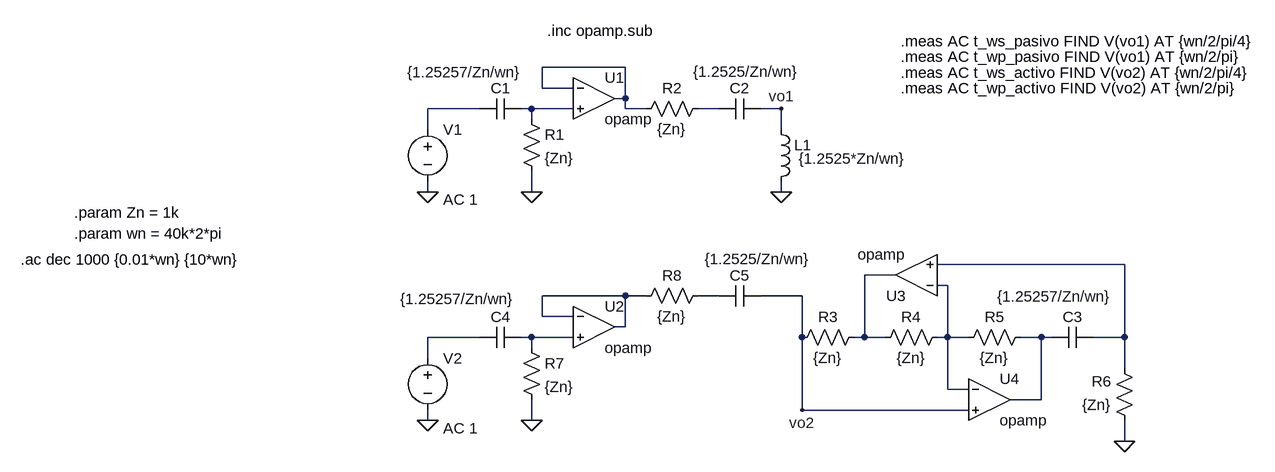
[diagram p0: schematic sim.asc]
sim.asc, the LTspice schematic file:
Version 4
SHEET 1 1212 680
WIRE 176 16 48 16
WIRE 48 48 48 16
WIRE 96 48 48 48
WIRE 176 64 176 16
WIRE 176 64 160 64
WIRE -48 80 -128 80
WIRE 32 80 16 80
WIRE 96 80 32 80
WIRE 176 80 176 64
WIRE 208 80 176 80
WIRE 320 80 288 80
WIRE 416 80 384 80
WIRE 32 96 32 80
WIRE -128 112 -128 80
WIRE 416 112 416 80
WIRE -128 208 -128 192
WIRE 32 208 32 176
WIRE 416 208 416 192
WIRE 944 320 656 320
WIRE 592 336 544 336
WIRE 672 352 656 352
WIRE 176 368 48 368
WIRE 208 368 176 368
WIRE 320 368 288 368
WIRE 448 368 384 368
WIRE 48 400 48 368
WIRE 96 400 48 400
WIRE 176 416 176 368
WIRE 176 416 160 416
WIRE -48 432 -128 432
WIRE 32 432 16 432
WIRE 96 432 32 432
WIRE 448 432 448 368
WIRE 544 432 544 336
WIRE 544 432 528 432
WIRE 576 432 544 432
WIRE 672 432 672 352
WIRE 672 432 656 432
WIRE 704 432 672 432
WIRE 816 432 784 432
WIRE 832 432 816 432
WIRE 944 432 944 320
WIRE 944 432 896 432
WIRE 32 448 32 432
WIRE -128 464 -128 432
WIRE 944 480 944 432
WIRE 672 512 672 432
WIRE 704 512 672 512
WIRE 816 528 816 432
WIRE 816 528 768 528
WIRE 448 544 448 432
WIRE 704 544 448 544
WIRE -128 560 -128 544
WIRE 32 560 32 528
WIRE 944 592 944 560
FLAG 32 208 0
FLAG 416 208 0
FLAG -128 208 0
FLAG 944 592 0
FLAG 32 560 0
FLAG -128 560 0
FLAG 416 80 vo1
FLAG 448 544 vo2
SYMBOL cap 16 64 R90
WINDOW 0 0 32 VBottom 2
WINDOW 3 -56 87 VTop 2
SYMATTR InstName C1
SYMATTR Value {1.25257/Zn/wn}
SYMBOL res 16 80 R0
SYMATTR InstName R1
SYMATTR Value {Zn}
SYMBOL res 304 64 R90
WINDOW 0 0 56 VBottom 2
WINDOW 3 32 56 VTop 2
SYMATTR InstName R2
SYMATTR Value {Zn}
SYMBOL cap 384 64 R90
WINDOW 0 0 32 VBottom 2
WINDOW 3 -57 22 VTop 2
SYMATTR InstName C2
SYMATTR Value {1.2525/Zn/wn}
SYMBOL ind 400 96 R0
WINDOW 3 43 61 Left 2
SYMATTR InstName L1
SYMATTR Value {1.2525*Zn/wn}
SYMBOL voltage -128 96 R0
WINDOW 123 24 124 Left 2
WINDOW 39 0 0 Left 0
SYMATTR InstName V1
SYMATTR Value ""
SYMATTR Value2 AC 1
SYMBOL OpAmps\\opamp 128 0 R0
SYMATTR InstName U1
SYMATTR SpiceLine2 GBW=10G
SYMBOL res 544 416 R90
WINDOW 0 0 56 VBottom 2
WINDOW 3 32 56 VTop 2
SYMATTR InstName R3
SYMATTR Value {Zn}
SYMBOL res 672 416 R90
WINDOW 0 0 56 VBottom 2
WINDOW 3 32 56 VTop 2
SYMATTR InstName R4
SYMATTR Value {Zn}
SYMBOL res 800 416 R90
WINDOW 0 0 56 VBottom 2
WINDOW 3 32 56 VTop 2
SYMATTR InstName R5
SYMATTR Value {Zn}
SYMBOL res 960 576 R180
WINDOW 0 36 76 Left 2
WINDOW 3 36 40 Left 2
SYMATTR InstName R6
SYMATTR Value {Zn}
SYMBOL cap 896 416 R90
WINDOW 0 0 32 VBottom 2
WINDOW 3 -63 59 VTop 2
SYMATTR InstName C3
SYMATTR Value {1.25257/Zn/wn}
SYMBOL cap 16 416 R90
WINDOW 0 0 32 VBottom 2
WINDOW 3 -59 98 VTop 2
SYMATTR InstName C4
SYMATTR Value {1.25257/Zn/wn}
SYMBOL res 16 432 R0
SYMATTR InstName R7
SYMATTR Value {Zn}
SYMBOL voltage -128 448 R0
WINDOW 123 24 124 Left 2
WINDOW 39 0 0 Left 0
SYMATTR InstName V2
SYMATTR Value ""
SYMATTR Value2 AC 1
SYMBOL res 304 352 R90
WINDOW 0 0 56 VBottom 2
WINDOW 3 32 56 VTop 2
SYMATTR InstName R8
SYMATTR Value {Zn}
SYMBOL cap 384 352 R90
WINDOW 0 0 32 VBottom 2
WINDOW 3 -56 4 VTop 2
SYMATTR InstName C5
SYMATTR Value {1.2525/Zn/wn}
SYMBOL OpAmps\\opamp 128 352 R0
SYMATTR InstName U2
SYMATTR SpiceLine2 GBW=10G
SYMBOL OpAmps\\opamp 624 400 R180
SYMATTR InstName U3
SYMATTR SpiceLine2 GBW=10G
SYMBOL OpAmps\\opamp 736 464 R0
SYMATTR InstName U4
SYMATTR SpiceLine2 GBW=10G
TEXT -754 312 Left 2 !.ac dec 1000 {0.01*wn} {10*wn}
TEXT 56 -40 Left 2 !.inc opamp.sub
TEXT -672 240 Left 2 !.param Zn = 1k
TEXT 600 -24 Left 2 !.meas AC t_ws_pasivo FIND V(vo1) AT {wn/2/pi/4}
TEXT -672 272 Left 2 !.param wn = 40k*2*pi
TEXT 600 0 Left 2 !.meas AC t_wp_pasivo FIND V(vo1) AT {wn/2/pi}
TEXT 600 24 Left 2 !.meas AC t_ws_activo FIND V(vo2) AT {wn/2/pi/4}
TEXT 600 48 Left 2 !.meas AC t_wp_activo FIND V(vo2) AT {wn/2/pi}

The netlist it stands for:
* sim.asc
C1 N003 N002 {1.25257/Zn/wn}
R1 N003 0 {Zn}
R2 N004 N001 {Zn}
C2 vo1 N004 {1.2525/Zn/wn}
L1 vo1 0 {1.2525*Zn/wn}
V1 N002 0 AC 1
XU1 N001 N003 N001 opamp Aol=100K GBW=10G  ; pins invin noninvin out
R3 N006 vo2 {Zn}
R4 N007 N006 {Zn}
R5 N012 N007 {Zn}
R6 0 N005 {Zn}
C3 N005 N012 {1.25257/Zn/wn}
C4 N011 N010 {1.25257/Zn/wn}
R7 N011 0 {Zn}
V2 N010 0 AC 1
R8 N009 N008 {Zn}
C5 vo2 N009 {1.2525/Zn/wn}
XU2 N008 N011 N008 opamp Aol=100K GBW=10G  ; pins invin noninvin out
XU3 N007 N005 N006 opamp Aol=100K GBW=10G  ; pins invin noninvin out
XU4 N007 vo2 N012 opamp Aol=100K GBW=10G  ; pins invin noninvin out
.ac dec 1000 {0.01*wn} {10*wn}
.inc opamp.sub
.param Zn = 1k
.meas AC t_ws_pasivo FIND V(vo1) AT {wn/2/pi/4}
.param wn = 40k*2*pi
.meas AC t_wp_pasivo FIND V(vo1) AT {wn/2/pi}
.meas AC t_ws_activo FIND V(vo2) AT {wn/2/pi/4}
.meas AC t_wp_activo FIND V(vo2) AT {wn/2/pi}
.backanno
.end